# EAGLE design ThunderBolt Nova (EAGLE 7.5.0)
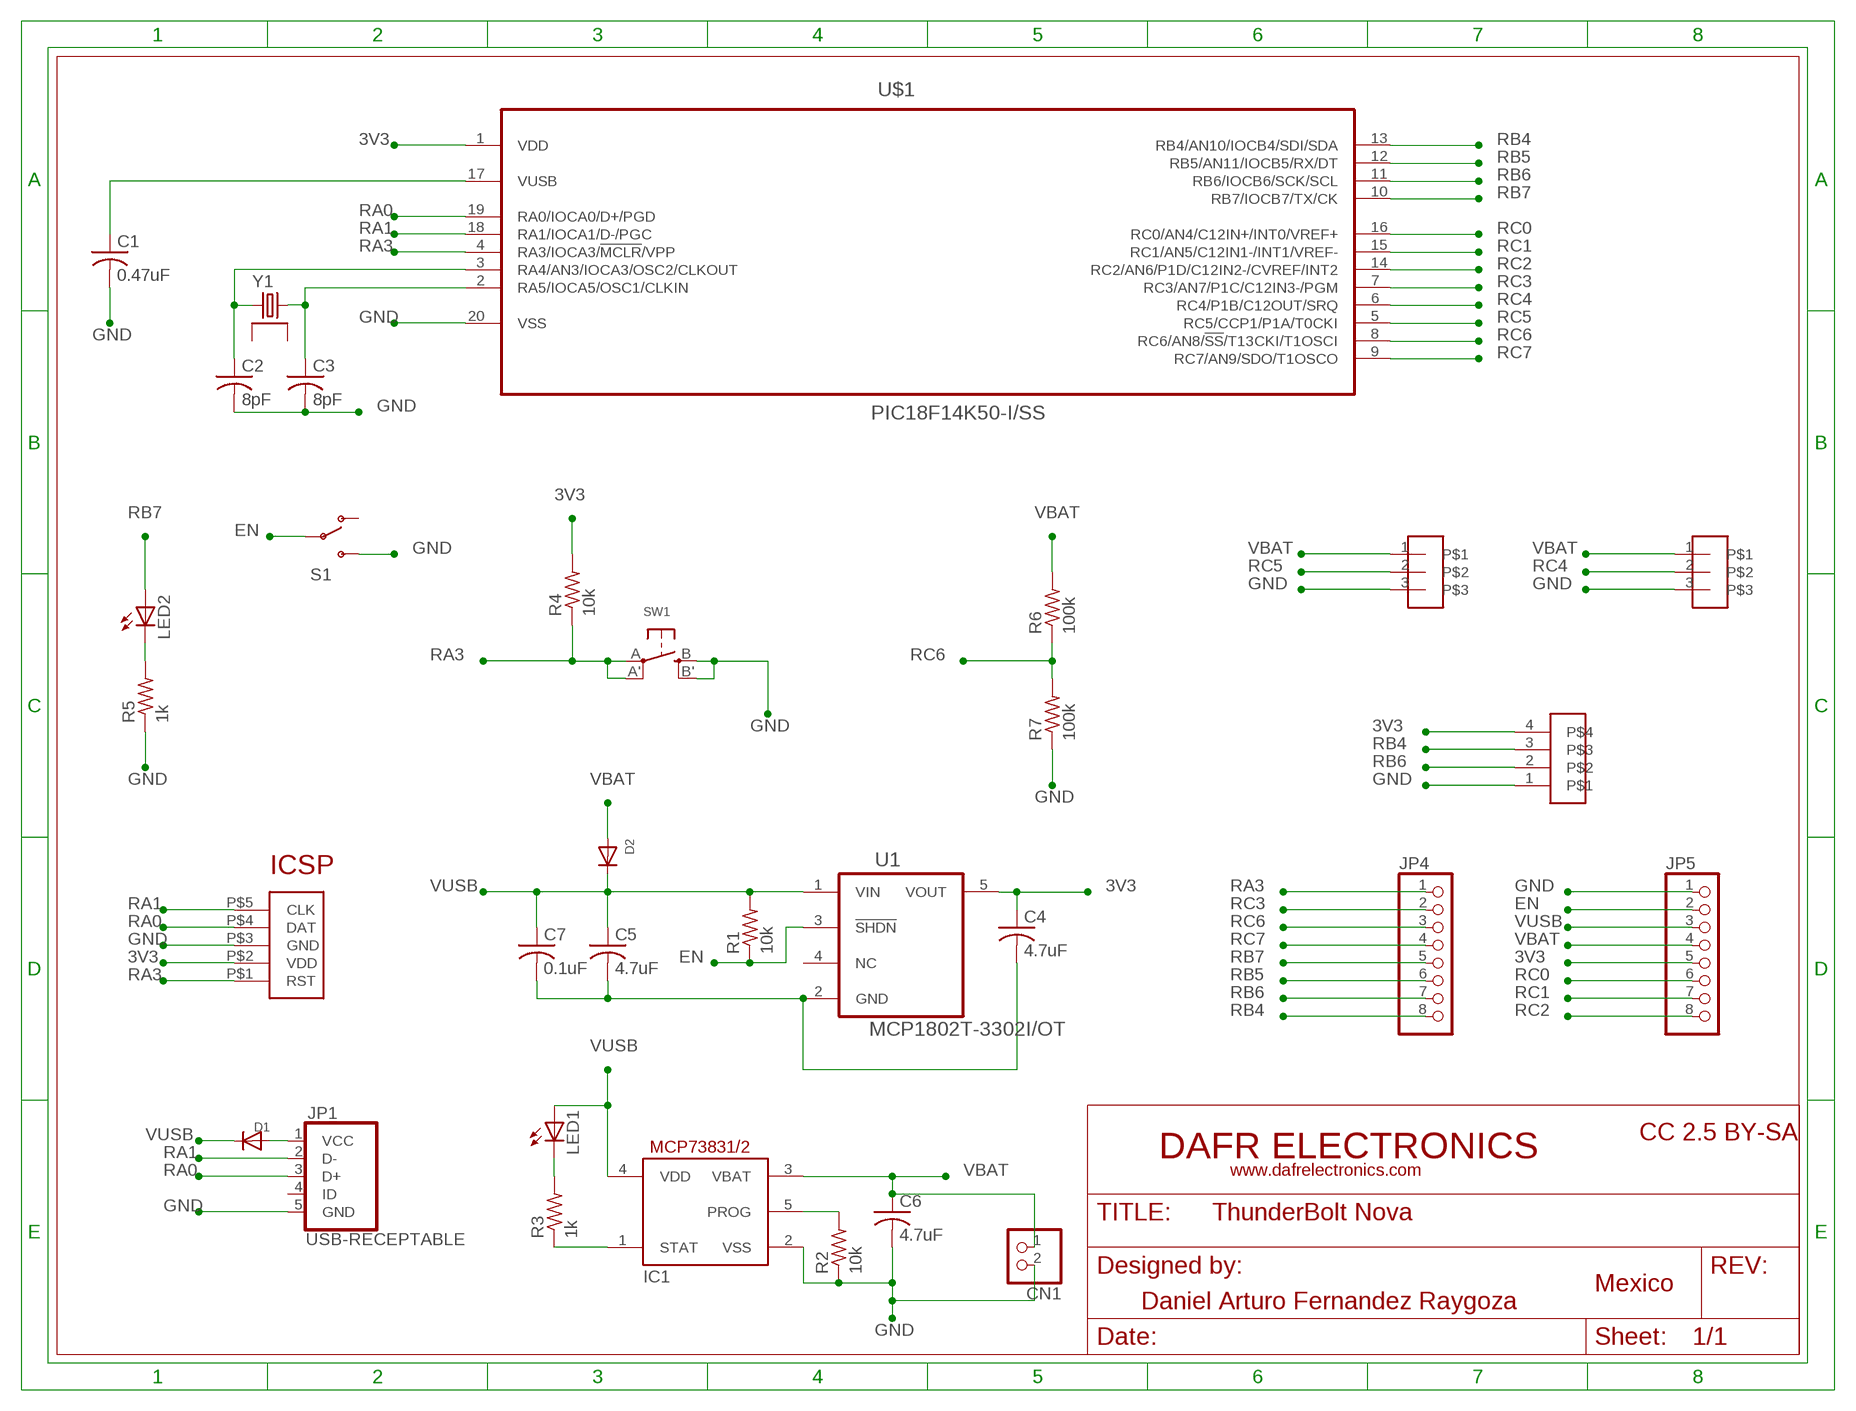
[diagram p0: schematic, sheet 1]

## Parts
C1  0.47uF  C-USC0805K  [C0805K]
C2  8pF  C-USC0805K  [C0805K]
C3  8pF  C-USC0805K  [C0805K]
C4  4.7uF  C-USC0805K  [C0805K]
C5  4.7uF  C-USC0805K  [C0805K]
C6  4.7uF  C-USC0805K  [C0805K]
C7  0.1uF  C-USC0603K  [C0603K]
CN1  JST_2PIN-SMT-RA  [JST-PH-2-SMT-RA]
D1  DIODESOD-123  [SOD-123]
D2  DIODESOD-123  [SOD-123]
IC1  MCP73831/OT  [SOT23-5L]
JP1  USB-RECEPTABLE  [FCI-10103594-0001LF]
JP4  PINHD-1X8BIG  [1X08-BIG]
JP5  PINHD-1X8BIG  [1X08-BIG]
LED1  LEDCHIPLED_1206  [CHIPLED_1206]
LED2  LEDCHIPLED_1206  [CHIPLED_1206]
R1  10k  R-US_R0805  [R0805]
R2  10k  R-US_R0805  [R0805]
R3  1k  R-US_R0805  [R0805]
R4  10k  R-US_R0805  [R0805]
R5  1k  R-US_R0805  [R0805]
R6  100k  R-US_R0805  [R0805]
R7  100k  R-US_R0805  [R0805]
S1  SWITCH-SPDT-SMD-A  [SWITCH-SPST-SMD-A]
SW1  SWITCH_TACT_SMT4.6X2.8  [BTN_KMR2_4.6X2.8]
U1  MCP1802T-3302I/OT  [SOT95P270X145-5N]
U$1  PIC18F14K50-I/SS  [SOP65P780X200-20N]
U$2  ICSP_POGO  [ICSP_POGO]
U$5  PIN1X3  [PIN1X3]
U$6  PIN1X3  [PIN1X3]
U$7  PIN1X4  [PIN1X4]
Y1  GRX-330  [OSC3225]

## Nets
3V3: C4.1 JP5.5 R4.2 U1.5(VOUT) U$1.1(VDD) U$2.P$2(VDD) U$7.4
EN: JP5.2 R1.1 S1.2(P) U1.3(!SHDN)
GND: C1.2 C2.2 C3.2 C6.2 CN1.2 IC1.2(VSS) JP1.5(GND) JP5.1 R2.1 R5.1 R7.1 S1.3(S) SW1.B'(S1) SW1.B(S) U$1.20(VSS) U$2.P$3(GND) U$5.3 U$6.3 U$7.1
N$4: C1.1 U$1.17(VUSB)
N$6: C2.1 U$1.3(RA4/AN3/IOCA3/OSC2/CLKOUT) Y1.P$1
N$7: C3.1 U$1.2(RA5/IOCA5/OSC1/CLKIN) Y1.P$3
N$8: D1.A JP1.1(VCC)
N$10: C4.2 C5.2 C7.2 U1.2(GND)
N$11: IC1.1(STAT) R3.1
N$12: LED1.C R3.2
N$14: IC1.5(PROG) R2.2
N$15: LED2.C R5.2
RA0: JP1.3(D+) U$1.19(RA0/IOCA0/D+/PGD) U$2.P$4(DAT)
RA1: JP1.2(D-) U$1.18(RA1/IOCA1/D-/PGC) U$2.P$5(CLK)
RA3: JP4.1 R4.1 SW1.A'(P1) SW1.A(P) U$1.4(RA3/IOCA3/!MCLR!/VPP) U$2.P$1(RST)
RB4: JP4.8 U$1.13(RB4/AN10/IOCB4/SDI/SDA) U$7.3
RB5: JP4.6 U$1.12(RB5/AN11/IOCB5/RX/DT)
RB6: JP4.7 U$1.11(RB6/IOCB6/SCK/SCL) U$7.2
RB7: JP4.5 LED2.A U$1.10(RB7/IOCB7/TX/CK)
RC0: JP5.6 U$1.16(RC0/AN4/C12IN+/INT0/VREF+)
RC1: JP5.7 U$1.15(RC1/AN5/C12IN1-/INT1/VREF-)
RC2: JP5.8 U$1.14(RC2/AN6/P1D/C12IN2-/CVREF/INT2)
RC3: JP4.2 U$1.7(RC3/AN7/P1C/C12IN3-/PGM)
RC4: U$1.6(RC4/P1B/C12OUT/SRQ) U$5.2
RC5: U$1.5(RC5/CCP1/P1A/T0CKI) U$6.2
RC6: JP4.3 R6.1 R7.2 U$1.8(RC6/AN8/!SS!/T13CKI/T1OSCI)
RC7: JP4.4 U$1.9(RC7/AN9/SDO/T1OSCO)
VBAT: C6.1 CN1.1 D2.A IC1.3(VBAT) JP5.4 R6.2 U$5.1 U$6.1
VUSB: C5.1 C7.1 D1.C D2.C IC1.4(VDD) JP5.3 LED1.A R1.2 U1.1(VIN)
Unconnected: JP1.4(ID) S1.1(O) U1.4(NC) Y1.P$2 Y1.P$4

## Library data of the parts
C1-C7 = adafruit:C-US: CAPACITOR, American symbol
CN1 = adafruit:JST_2PIN: JST 2-Pin Connectors of various flavors SMT-RA (S2B-PH-SM4) 4UConnector #17311 SMT (B2B-PH-SM4) THM-RA (S2B-PH) THM (B2B-PH)
D1 D2 = adafruit:DIODE: Diode SMADIODE - SMA Surface Mount Package 20V 1A Schottky Diode Digikey: 641-1014-6-ND DO-1N4148 - Through Hole Small Current Diode SOD-123 20V 1 A (.5mV Vf) Schottky Diode - Digikey: MBRX120TPMSCT-ND SOD-323 10V 570mA (.38mV Vf, 3ns) Schottky Diode - Digikey: ZLLS410CT-ND SOD-523 30V 30mA Schottky Diode (RB751S-40TE61) - Digikey: RB751S-40TE61CT-ND SOT23-R/W - SOT23 Package (R = Solder Paste/Reflow Ovens, W = Hand-Soldering) BAT54Film 40V 300mA - Digikey: 497-7162-1-ND
IC1 = adafruit:MCP73831: MCP73831/2 Miniature Single-Cell, Fully Integrated Li-Ion, Li-Polymer Charge Management Controllers. Nice and small simple lipoly charge controller, with adjustable current and status output (LED) http://www.ladyada.net/library/pcb/eaglelibrary.html
JP1 = daspilker:USB-RECEPTABLE: USB Receptable
JP4 JP5 = adafruit:PINHD-1X8: PIN HEADER
LED1 LED2 = adafruit:LED: LED OSRAM: - CHIPLED LG R971, LG N971, LY N971, LG Q971, LY Q971, LO R971, LY R971 LH N974, LH R974 LS Q976, LO Q976, LY Q976 LO Q996 - Hyper CHIPLED LW Q18S LB Q993, LB Q99A, LB R99A - SideLED LS A670, LO A670, LY A670, LG A670, LP A670 LB A673, LV A673, LT A673, LW A673 LH A674 LY A675 LS A676, LA A676, LO A676, LY A676, LW A676 LS A679, LY A679, LG A679 - Hyper Micro SIDELED® LS Y876, LA Y876, LO Y876, LY Y876 LT Y87S - SmartLED LW L88C, LW L88S LB L89C, LB L89S, LG L890 LS L89K, LO L89K, LY L89K LS L896, LA L896, LO L896, LY L896 - TOPLED LS T670, LO T670, LY T670, LG T670, LP T670 LSG T670, LSP T670, LSY T670, LOP T670, LYG T670 LG T671, LOG T671, LSG T671 LB T673, LV T673, LT T673, LW T673 LH T674 LS T676, LA T676, LO T676, LY T676, LB T676, LH T676, LSB T676, LW T676 LB T67C, LV T67C, LT T67C, LS T67K, LO T67K, LY T67K, LW E67C LS E67B, LA E67B, LO E67B, LY E67B, LB E67C, LV E67C, LT E67C LW T67C LS T679, LY T679, LG T679 LS T770, LO T770, LY T770, LG T770, LP T770 LB T773, LV T773, LT T773, LW T773 LH T774 LS E675, LA E675, LY E675, LS T675 LS T776, LA T776, LO T776, LY T776, LB T776 LHGB T686 LT T68C, LB T68C - Hyper Mini TOPLED® LB M676 - Mini TOPLED Santana® LG M470 LS M47K, LO M47K, LY M47K Source: http://www.osram.convergy.de/
R1-R7 = adafruit:R-US_: RESISTOR, American symbol
S1 = SparkFun-Electromechanical:SWITCH-SPDT: SPDT Switch Simple slide switch, Spark Fun Electronics SKU : COM-00102 DPDT SMT slide switch, AYZ0202, SWCH-08179
SW1 = microbuilder:SWITCH_TACT_SMT: SMT Tact Switches 6x6mm - Digikey: P12940SCT-ND KMR2 (4.6x2.8mm) - Digikey: 401-1426-1-ND EVQ-PQHB55 - Light Touch, 160GF (4.5x4.5mm) - Digikey: P8090SCT-ND KMT0 - KMT021 NGJ LHS (etc.) IP68/Waterproof - Digikey: CKN10289CT-ND
U1 = Microchip-MCP1802T-3302I_OT:MCP1802T-3302I/OT: 300 mA, High PSRR, Low Quiescent Current LDO, SOT23-5; MPN: MCP1802T-3302I/OT; OC_FARNELL: Unknown; OC_NEWARK: 54M4838; PACKAGE: SOT23-5; SUPPLIER: Microchip
U$1 = PIC 18F14K50:PIC18F14K50-I/SS: USB Flash Microcontrollers; MPN: PIC18F14K50-I/SS; OC_FARNELL: 1648504; OC_NEWARK: 77M3105; PACKAGE: SOP-20; SUPPLIER: Microchip
U$2 = ICSP_POGO:ICSP_POGO
U$5 U$6 = pines 2brobots:PIN1X3
U$7 = pines 2brobots:PIN1X4
Y1 = golledge_full_v1-0:GRX-330: Crystal |SM| 3.2 x 2.5 mm | AT cut | Frequency Range 12 - 40 MHz AEC-Q200 qualified for automotive applications Vacuum seal for excellent long-term stability High reliability at low cost Metal lid grounded to minimise EMI Datasheet <http://www.golledge.com/docs/products/xtl_sm/grx330.htm?src=eagle>; HEIGHT: 0.8

## Board
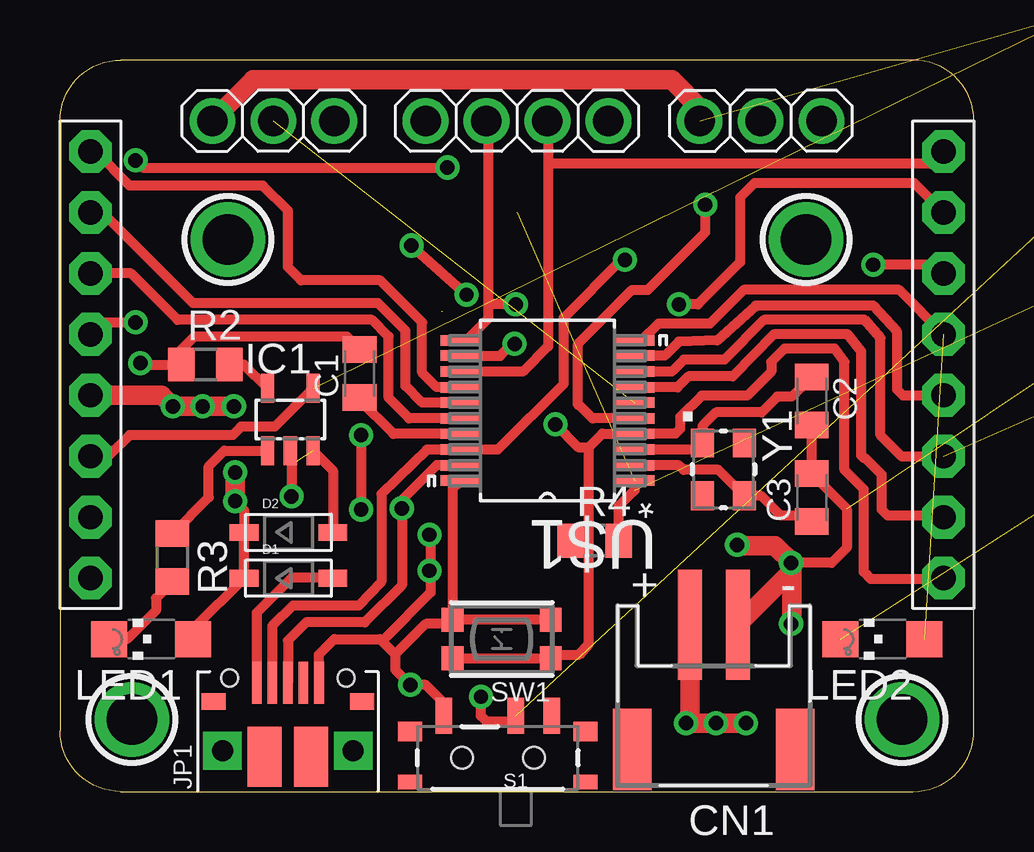
[diagram p1: board, top side]
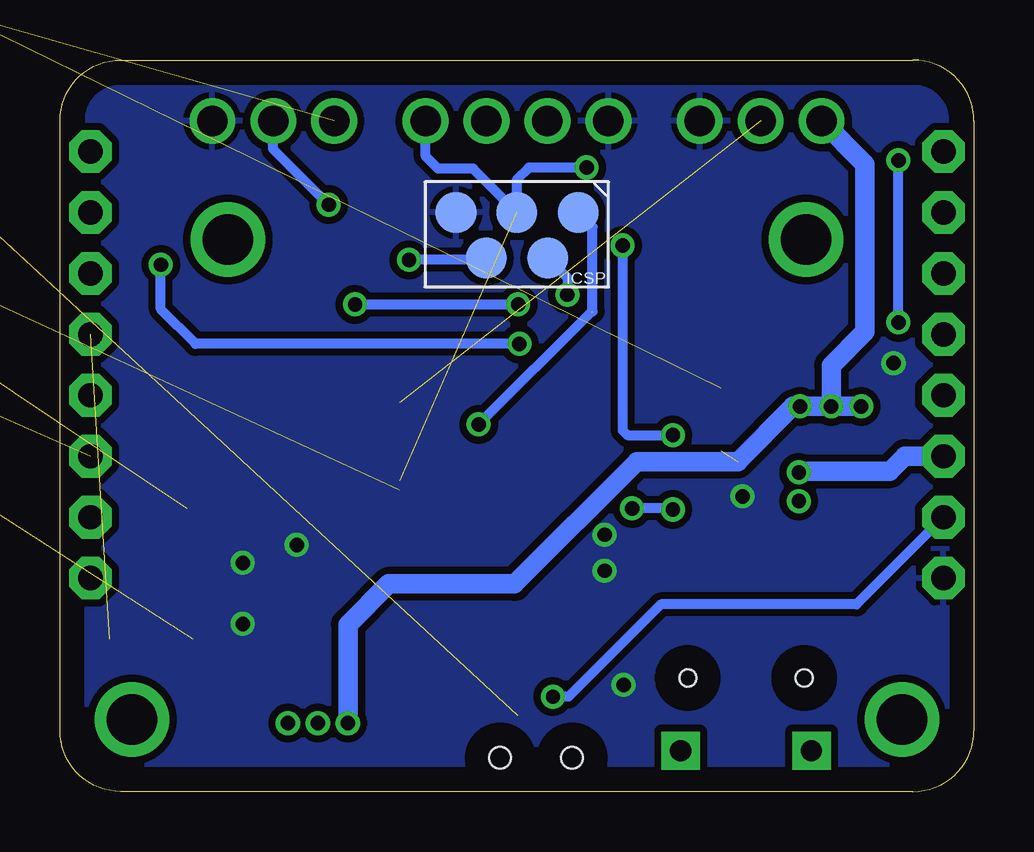
[diagram p2: board, bottom side, seen from below]

Size 38.1 x 30.48 mm. Coordinates in mm from the lower left corner, seen from the top.
Outline: 2.54,0 35.56,0 arc90 38.1,2.54 38.1,27.94 arc90 35.56,30.48 2.54,30.48 arc90 0,27.94 0,2.54 arc90 2.54,0
Copper layers (1*16): Top 0.035mm / dielectric 1.5mm / Bottom 0.035mm
Design rules "default": minimum track width 10mil, minimum drill 24mil, track to track 8mil, track to pad 8mil, pad to pad 8mil, via to via 8mil, smd to smd 8mil, copper to edge 40mil, drill to drill 8mil, minimum pad ring 10mil, minimum via ring 8mil, stop-mask expansion 4mil, vias tented up to drill 0mil, thermal gap 10mil

### Footprints (pad centres in the part's own frame; a part is rotated, then mirrored left to right if it is on the bottom)
C0805K = smd 1.1 x 1.4: 1 -1,0; 2 1,0
C0603K = smd 1.05 x 1.08: 1 -0.875,0; 2 0.875,0
JST-PH-2-SMT-RA = smd 1 x 4.6: 1 1,-3.7; 2 -1,-3.7 | smd 1.6 x 3.4: NC1 -3.4,1.5; NC2 3.4,1.5
SOD-123 = smd 1.2 x 0.7: A 1.85,0; C -1.85,0
SOT23-5L = smd 0.55 x 1.2: 1 -0.95,-1.3; 2 0,-1.3; 3 0.95,-1.3; 4 0.95,1.3; 5 -0.95,1.3
FCI-10103594-0001LF = smd 0.4 x 1.75: 1 -1.3,4.525; 2 -0.65,4.525; 3 0,4.525; 4 0.65,4.525; 5 1.3,4.525 | smd 1 x 0.7: P$1 3.1,3.75; P$6 -3.1,3.75 | smd 1.425 x 2.5: P$2 0.963,1.45; P$5 -0.963,1.45 | drill 0.88 pad 1.6 square: P$3 -2.725,1.7; P$4 2.725,1.7 | hole 0.7: -2.425,4.73; 2.425,4.73
1X08-BIG = drill 1.016 pad 1.778 octagon: 1 -8.89,0; 2 -6.35,0; 3 -3.81,0; 4 -1.27,0; 5 1.27,0; 6 3.81,0; 7 6.35,0; 8 8.89,0
CHIPLED_1206 = smd 1.5 x 1.5: A 0,-1.75; C 0,1.75
R0805 = smd 1.1 x 1.4: 1 -1,0; 2 1,0
SWITCH-SPST-SMD-A = smd 0.7 x 1.5: 1 -2.25,-1.75; 2 -0.75,-1.75; 3 2.25,-1.75 | smd 1 x 0.6: GND1 -3.65,1; GND3 3.65,1 | smd 1 x 0.8: GND2 -3.65,-1.1; GND4 3.65,-1.1 | hole 0.9: -1.5,0; 1.5,0
BTN_KMR2_4.6X2.8 = smd 0.9 x 1: A 2.05,0.8; A' -2.05,0.8; B 2.05,-0.8; B' -2.05,-0.8
SOT95P270X145-5N = smd 1.321 x 0.559: 1 -1.372,0.94; 2 -1.372,0; 3 -1.372,-0.94; 4 1.372,-0.94; 5 1.372,0.94
SOP65P780X200-20N = smd 1.651 x 0.432: 1 -3.632,2.921; 2 -3.632,2.286; 3 -3.632,1.626; 4 -3.632,0.965; 5 -3.632,0.33; 6 -3.632,-0.33; 7 -3.632,-0.965; 8 -3.632,-1.626; 9 -3.632,-2.286; 10 -3.632,-2.921; 11 3.632,-2.921; 12 3.632,-2.286; 13 3.632,-1.626; 14 3.632,-0.965; 15 3.632,-0.33; 16 3.632,0.33; 17 3.632,0.965; 18 3.632,1.626; 19 3.632,2.286; 20 3.632,2.921
ICSP_POGO = smd 1.7 x 1.7: P$1 -2.55,0; P$2 0.01,0; P$3 2.54,0; P$4 -1.275,1.9; P$5 1.275,1.9
PIN1X3 = drill 1.27: 1 -2.54,0; 2 0,0; 3 2.54,0
PIN1X4 = drill 1.27: 1 -3.81,0; 2 -1.27,0; 3 1.27,0; 4 3.81,0
OSC3225 = smd 1.2 x 0.95: P$1 -1.1,-0.875; P$2 1.1,-0.875; P$3 1.1,0.875; P$4 -1.1,0.875

### Placement (x,y rotation side)
C1  12.49,17.42 90 top
C2  31.34,16.28 270 top
C3  31.34,12.25 90 top
C4  66.62,31.79 0 top  (outside the outline)
C5  76.78,48.3 0 top  (outside the outline)
C6  76.78,41.95 0 top  (outside the outline)
C7  86.94,24.17 0 top  (outside the outline)
CN1  27.25,3.25 180 top
D1  9.53,8.89 0 top
D2  9.53,10.79 0 top
IC1  9.6,15.5 0 top
JP1  9.5,0 0 top
JP4  36.83,17.78 90 top
JP5  1.27,17.78 90 top
LED1  3.81,6.35 90 top
LED2  34.29,6.35 90 top
R1  63.28,43.13 0 top  (outside the outline)
R2  6.07,17.79 0 top
R3  4.69,9.75 270 top
R4  22.29,10.45 0 top
R5  86.94,41.95 0 top  (outside the outline)
R6  86.94,35.6 0 top  (outside the outline)
R7  86.94,29.25 0 top  (outside the outline)
S1  18.25,1.4 180 top
SW1  18.41,6.35 180 top
U1  75.51,34.33 0 top  (outside the outline)
U$1  20.32,15.88 180 top
U$2  19.05,24.13 180 bottom
U$5  8.89,27.94 0 top
U$6  29.21,27.94 0 top
U$7  19.05,27.94 0 top
Y1  27.66,13.42 270 top

### Tracks (layer width: path | path; a pad name or v marks a point on that pad's centre or on a via)
3V3  (via drill 0.6)  (3 unrouted)
  Top 0.406: R4.2 23.3,11.9 23.95,12.55 U$1.1 | JP5.5 1.77,19.55 v3.15,19.55 | v3.15,26.3 3.45,26 v16.15,26
  Bottom 0.406: U$7.4 22.86,26.46 22.35,25.95 20.88,25.95 U$2.P$2 19.06,25.49 18.55,26 v16.15,26 | v3.15,19.55 v3.15,26.3
EN  (via drill 0.6)  (2 unrouted)
  Top 0.406: S1.2 18.75,2.9 17.8,2.9 17.55,3.15 v17.55,3.95
  Bottom 0.406: JP5.2 4.9,7.8 13.05,7.8 16.9,3.95 v17.55,3.95
GND  (via drill 0.6)  (3 unrouted)
  Top 0.406: S1.3 15.88,3.27 15.88,3.81 15.24,4.45 v14.61,4.45 13.97,5.08 13.97,5.71 | JP1.5 10.79,5.71 11.43,6.35 13.34,6.35 13.97,5.71 | SW1.B' SW1.B | SW1.B 16.2,6.99 15.24,6.99 13.97,5.71 | v15.4,10.7 15.45,10.65 15.45,8.3 13.5,6.35 13.5,6.3 | U$1.20 16.36,12.63 SW1.B | C2.2 C3.2 32.8,11.79 32.8,10.15 32.17,9.53 v30.48,9.53 | IC1.2 9.65,14.15 v9.65,12.3 | v3.35,17.85 3.41,17.79 R2.1 5.07,18.42 5.6,18.95 11.96,18.95 C1.2
  Top 0.813: 30.45,6.95 v30.48,6.99 30.5,7 30.5,9.55 29.8,10.25 28.2,10.25 | CN1.2 30.48,9.18 v30.48,9.53
  other vias: 15.4,9.2 28.23,10.28
  pour Bottom (isolate 0.3): 0,30.48 0,0 38.1,0 38.1,30.48
N$1  (via drill 2.1 pad 2.54)
  other vias: 7,23
N$2  (via drill 2.1 pad 2.54)
  other vias: 31.1,23
N$3  (via drill 2.1 pad 2.54)
  other vias: 3,3
N$4
  Top 0.406: U$1.17 16.68,14.9 13.9,14.9 12.49,16.31 C1.1
N$5  (via drill 2.1 pad 2.54)
  other vias: 35.1,3
N$6
  Top 0.406: U$1.3 26.51,14.25 Y1.P$1 26.79,15.23 27.35,15.8 29.25,15.8 29.9,16.45 30.51,16.45 C2.1
N$7
  Top 0.406: U$1.2 25.81,13.59 26,13.4 27.45,13.4 Y1.P$3 29.23,12.32 30.05,11.5 31.09,11.5 C3.1
N$8
  Top 0.406: D1.A 11.37,8.9 9.65,8.9 8.2,7.45 JP1.1
N$10  (3 unrouted)
N$11
  Top 0.406: R3.1 6.2,12.26 6.2,13.55 6.85,14.2 IC1.1
N$12
  Top 0.406: R3.2 4,8.06 4,7.55 2.8,6.35 LED1.C
N$14
  Top 0.406: IC1.5 7.66,17.79 R2.2
N$15  (1 unrouted)
RA0  (via drill 0.6)
  Top 0.406: U$1.19 16.68,13.6 15.7,13.6 14.25,12.15 v14.25,11.8 14.25,8.6 12.7,7.05 10.25,7.05 9.5,6.3 JP1.3 | v16.95,20.7 v14.65,22.75 | v12.55,14.85 v12.55,11.75
  Bottom 0.406: U$2.P$4 16.95,21.41 v16.95,20.7 | v14.65,22.75 14.65,15.05 14.45,14.85 v12.55,14.85 | v12.55,11.75 12.6,11.8 v14.25,11.8
RA1  (via drill 0.6)
  Top 0.406: JP1.2 8.85,6.9 9.7,7.75 12.45,7.75 13.4,8.75 13.4,12.4 15.3,14.25 U$1.18 18.25,14.25 21,17 21,19.75 23.4,22.15 v23.55,22.15
  Bottom 0.406: U$2.P$5 20.41,22.15 v23.55,22.15
RA3  (via drill 0.6)  (1 unrouted)
  Top 0.406: SW1.A SW1.A' 20.61,5.7 21.65,5.7 22.05,6.15 22.05,10.35 | 22.05,10.35 22.05,14.35 | 22.05,14.35 22.61,14.91 U$1.4 25.66,14.91 25.85,15.1 25.85,15.6 26.75,16.5 28.65,16.5 29.65,17.5 29.65,17.9 30.2,18.45 32.3,18.45 32.7,17.9 32.7,13.4 33.5,12.6 33.5,9.15 33.8,8.85 36.79,8.85 JP4.1 | R4.1 21.39,10.35 22.05,10.35 | v20.65,15.3 21.6,14.35 22.05,14.35
  Bottom 0.406: U$2.P$1 15.9,23.53 15.9,20 | v20.65,15.3 15.95,20
RB4
  Top 0.406: U$7.3 20.35,27.91 20.35,26.15 | 20.35,26.15 20.35,18.55 19.3,17.5 U$1.13 | JP4.8 36.31,26.15 20.35,26.15
RB5  (via drill 0.6)
  Top 0.406: U$1.12 18.35,18.15 18.85,18.65 v18.95,18.65 | JP4.6 36.47,21.95 v33.9,21.95
  Bottom 0.406: v18.95,18.65 32.45,18.65 33.9,20.1 v33.9,21.95
RB6  (via drill 0.6)
  Top 0.406: U$7.2 17.85,27.87 17.85,20.3 | 17.85,20.3 17.85,19.7 16.95,18.8 U$1.11 | JP4.7 35.61,25.35 28.95,25.35 28.35,24.75 28.35,22.05 26.6,20.3 v25.8,20.3 | v19,20.3 17.85,20.3
  Bottom 0.406: v25.8,20.3 v19,20.3
RB7  (1 unrouted)
  Top 0.406: JP4.5 34.98,20.9 28.5,20.9 27.1,19.5 24.95,19.5 24.25,18.8 U$1.10
RC0
  Top 0.406: U$1.16 14.55,15.55 13.7,16.4 13.7,18.95 13,19.65 4.9,19.65 2.96,21.59 JP5.6
RC1
  Top 0.406: U$1.15 15.1,16.2 14.4,16.9 14.4,19.2 13.25,20.35 5.55,20.35 1.77,24.13 JP5.7
RC2
  Top 0.406: U$1.14 16.68,16.85 15.7,16.85 15.1,17.45 15.1,19.55 13.35,21.3 10.05,21.3 9.5,21.85 9.5,24.2 8.45,25.25 2.9,25.25 1.48,26.67 JP5.8
RC3
  Top 0.406: JP4.2 36.76,11.5 34.5,11.5 34.25,11.75 34.25,13.2 33.55,13.9 33.5,13.9 33.4,14 33.4,18.35 32.85,19.05 29.75,19.05 28.05,17.3 26.2,17.3 25.74,16.84 U$1.7
RC4  (1 unrouted)
RC5  (via drill 0.6)
  Top 0.406: U$1.5 22.2,15.55 21.65,16.1 21.6,16.1 21.6,18.65 23.85,20.9 24.5,20.9 26.9,23.3 v26.9,24.45
  Bottom 0.406: v26.9,24.45 29.21,26.76 U$6.2
RC6  (2 unrouted)
  Top 0.406: JP4.3 36.81,13.95 35.1,13.95 34.2,14.85 34.2,18.9 33.55,19.65 29.35,19.65 27.7,18 26,18 25.5,17.5 U$1.8
RC7
  Top 0.406: JP4.4 35.15,16.5 34.9,16.75 34.9,19.15 33.9,20.25 29,20.25 27.4,18.8 25.8,18.75 25.21,18.16 U$1.9
VBAT  (via drill 0.6)  (3 unrouted)
  Top 0.406: IC1.3 11.38,13.38 D2.A
  Top 0.813: v28.6,2.85 v27.35,2.85 v26.1,2.85 26.25,3 CN1.1 | U$5.1 8.06,29.65 25.5,29.65 26.67,28.48 U$6.1 | v7.25,16.05 v5.95,16.05 v4.7,16.05 4.24,16.51 JP5.4
  Bottom 0.813: v26.1,2.85 26.1,6.95 24.4,8.65 19.15,8.65 14.05,13.75 9.85,13.75 7.55,16.05 v4.7,16.05 | U$5.1 4.55,26.14 4.55,19.15 5.95,17.75 v5.95,16.05
VUSB  (via drill 0.6)  (4 unrouted)
  Top 0.406: LED1.A 5.56,6.78 D1.C D2.C 7.67,11.72 v7.3,12.1 | IC1.4 8.95,15.2 7.55,15.2 7.2,14.85 2.9,14.85 2.02,13.97 JP5.3
  Top 0.813: v7.3,12.1 v7.3,13.3
  Bottom 0.813: v7.3,13.3 7.25,13.35 3.5,13.35 2.88,13.97 JP5.3